# Altium schematic sheet PHY6222(20211120)（电感）新.SCHDOC
size A4
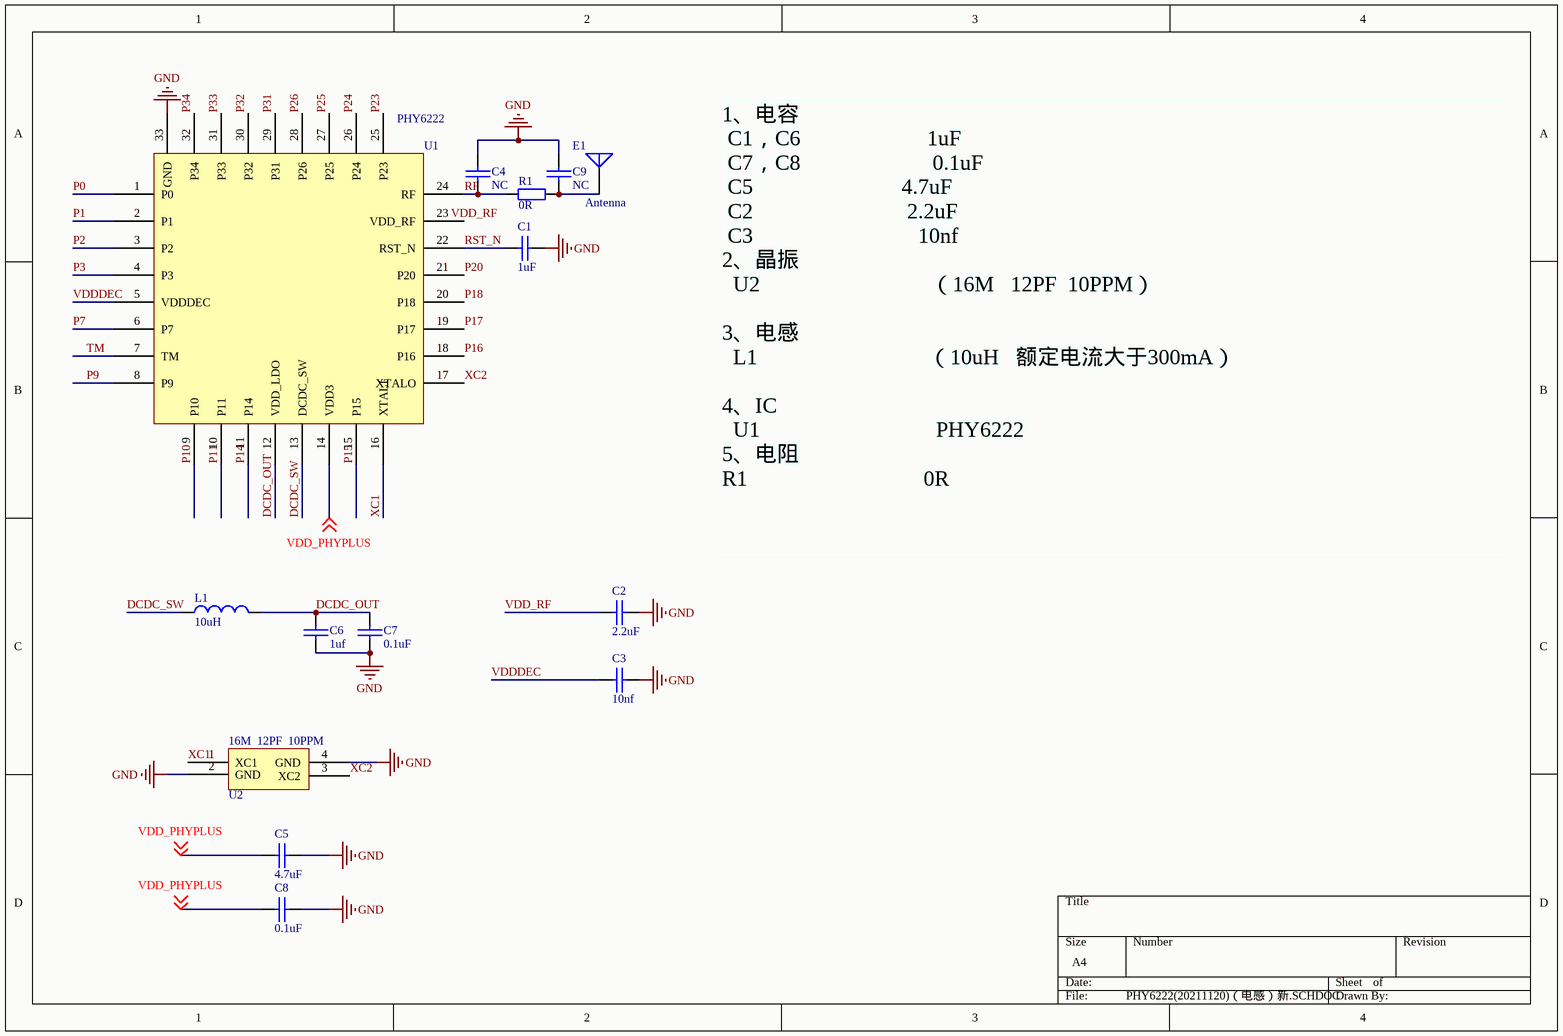
[diagram p0: PHY6222(20211120)（电感）新.SCHDOC]

## Parts
16M_12PF_10PPM  U2  [3225]
C1  1uF  [C0603]
C2  2.2uF  [C0603]
C3  10nf  [C0603]
C4  NC  [C0603]
C5  4.7uF  [C0603]
C6  1uf  [C0603]
C7  0.1uF  [C0603]
C8  0.1uF  [C0603]
C9  NC  [C0603]
E1  Antenna  [SMB1]
L1  10uH  [SMD2016]
R1  0R  [AXIAL-0.4]
U1  PHY6222  [QFN32]

## Nets
GND: 16M_12PF_10PPM.2(GND) 16M_12PF_10PPM.4(GND) C1.1 C2.2 C3.2 C4.2 C5.2 C6.2 C7.2 C8.2 C9.2 U1.33(GND)
DCDC_OUT: C6.1 C7.1 L1.2 U1.12(VDD_LDO)
DCDC_SW: L1.1 U1.13(DCDC_SW)
P0: U1.1(P0)
P1: U1.2(P1)
P2: U1.3(P2)
P3: U1.4(P3)
P7: U1.6(P7)
P9: U1.8(P9)
P10: U1.9(P10)
P11: U1.10(P11)
P14: U1.11(P14)
P15: U1.15(P15)
P16: U1.18(P16)
P17: U1.19(P17)
P18: U1.20(P18)
P20: U1.21(P20)
P23: U1.25(P23)
P24: U1.26(P24)
P25: U1.27(P25)
P26: U1.28(P26)
P31: U1.29(P31)
P32: U1.30(P32)
P33: U1.31(P33)
P34: U1.32(P34)
RF: C4.1 R1.2 U1.24(RF)
RST_N: C1.2 U1.22(RST_N)
TM: U1.7(TM)
VDD_PHYPLUS: C5.1 C8.1 U1.14(VDD3) ; off-sheet VDD_PHYPLUS
VDD_RF: C2.1
VDDDEC: C3.1 U1.5(VDDDEC)
XC1: 16M_12PF_10PPM.1(XC1) U1.16(XTALI)
XC2: 16M_12PF_10PPM.3(XC2) U1.17(XTALO)
NetC9_1: C9.1 E1.1(A) R1.1

Not connected (* = marked no-connect by the designer): U1 23(VDD_RF)

## Notes on the sheet
- 1、电容
  C1，C6                       1uF
  C7，C8                        0.1uF
  C5                           4.7uF
  C2                            2.2uF
  C3                              10nf
  2、晶振
  U2                               （16M   12PF  10PPM）
  3、电感
  L1                               （10uH   额定电流大于300mA）
  4、IC
  U1                                PHY6222
  5、电阻
  R1                                0R
- Labels drawn without touching a wire or pin: VDD_RF

## Library data of the parts
16M_12PF_10PPM = 3225
C1-C9 = 电容瓷片
E1 = Antenna: Generic Antenna; Published: 24-Mar-1999; LatestRevisionDate: 17-Jul-2002; LatestRevisionNote: Re-released for DXP Platform.; PackageReference: PIN1; Publisher: Altium Limited
L1 = 电感: Code_IEC: 1005; Value: 2.2uH; Published: 8-Jun-2000; LatestRevisionDate: 17-Jul-2002; LatestRevisionNote: Re-released for DXP Platform.; PackageReference: 0402-A; Publisher: Altium Limited; Code_JEITA: 0402
R1 = Res2: Resistor; Value: 1K; Published: 8-Jun-2000; LatestRevisionDate: 17-Jul-2002; LatestRevisionNote: Re-released for DXP Platform.; PackageReference: AXIAL-0.4; Publisher: Altium Limited
U1 = QFN32-1202